# Altium schematic sheet S7CAS-PLEIADES-CARTE-MERE_P20_DAC-ADC-Spice-Models.SchDoc
size Tabloid; SheetNumber: 18; SheetTotal: 21; Sheet_Name: DAC ADC Spice Models; Size: 11x17
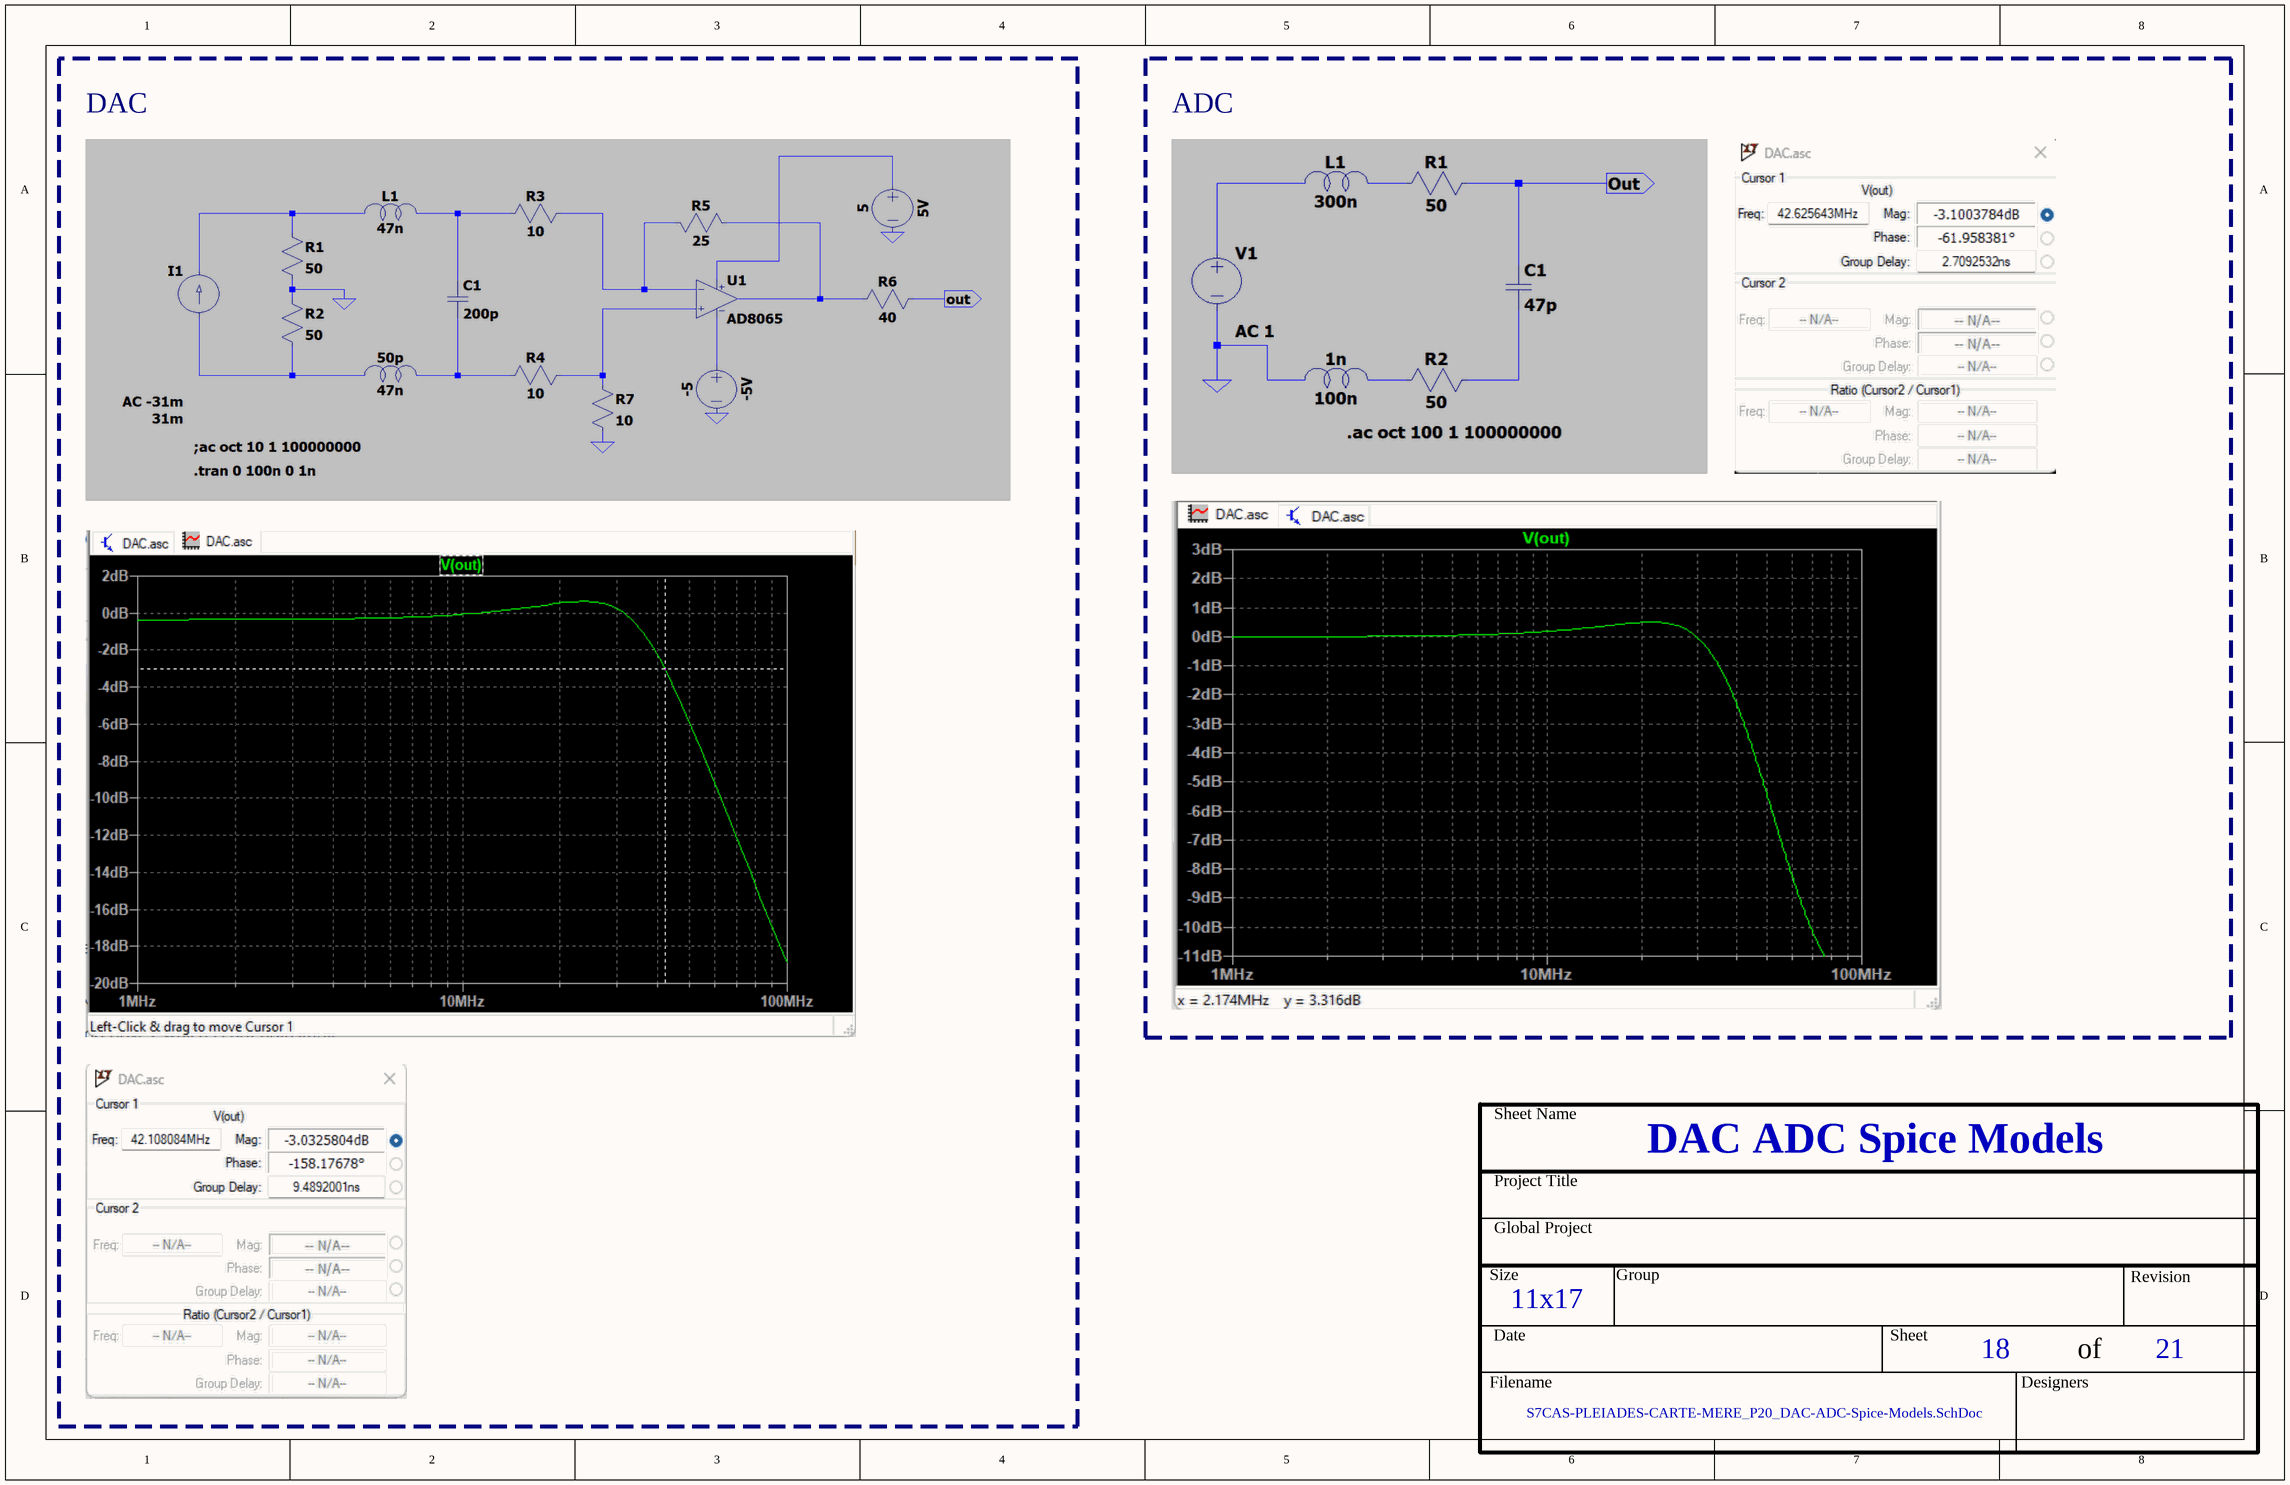
[diagram p0: S7CAS-PLEIADES-CARTE-MERE_P20_DAC-ADC-Spice-Models.SchDoc]

## Notes on the sheet
- DAC
- ADC
- Sheet Name
- Project Title
- Global Project
- Size
- Group
- Revision
- Date
- Sheet
- of
- Filename
- Designers